# EAGLE schematic BumbleBoard_V0.1 (EAGLE 6.5.0)
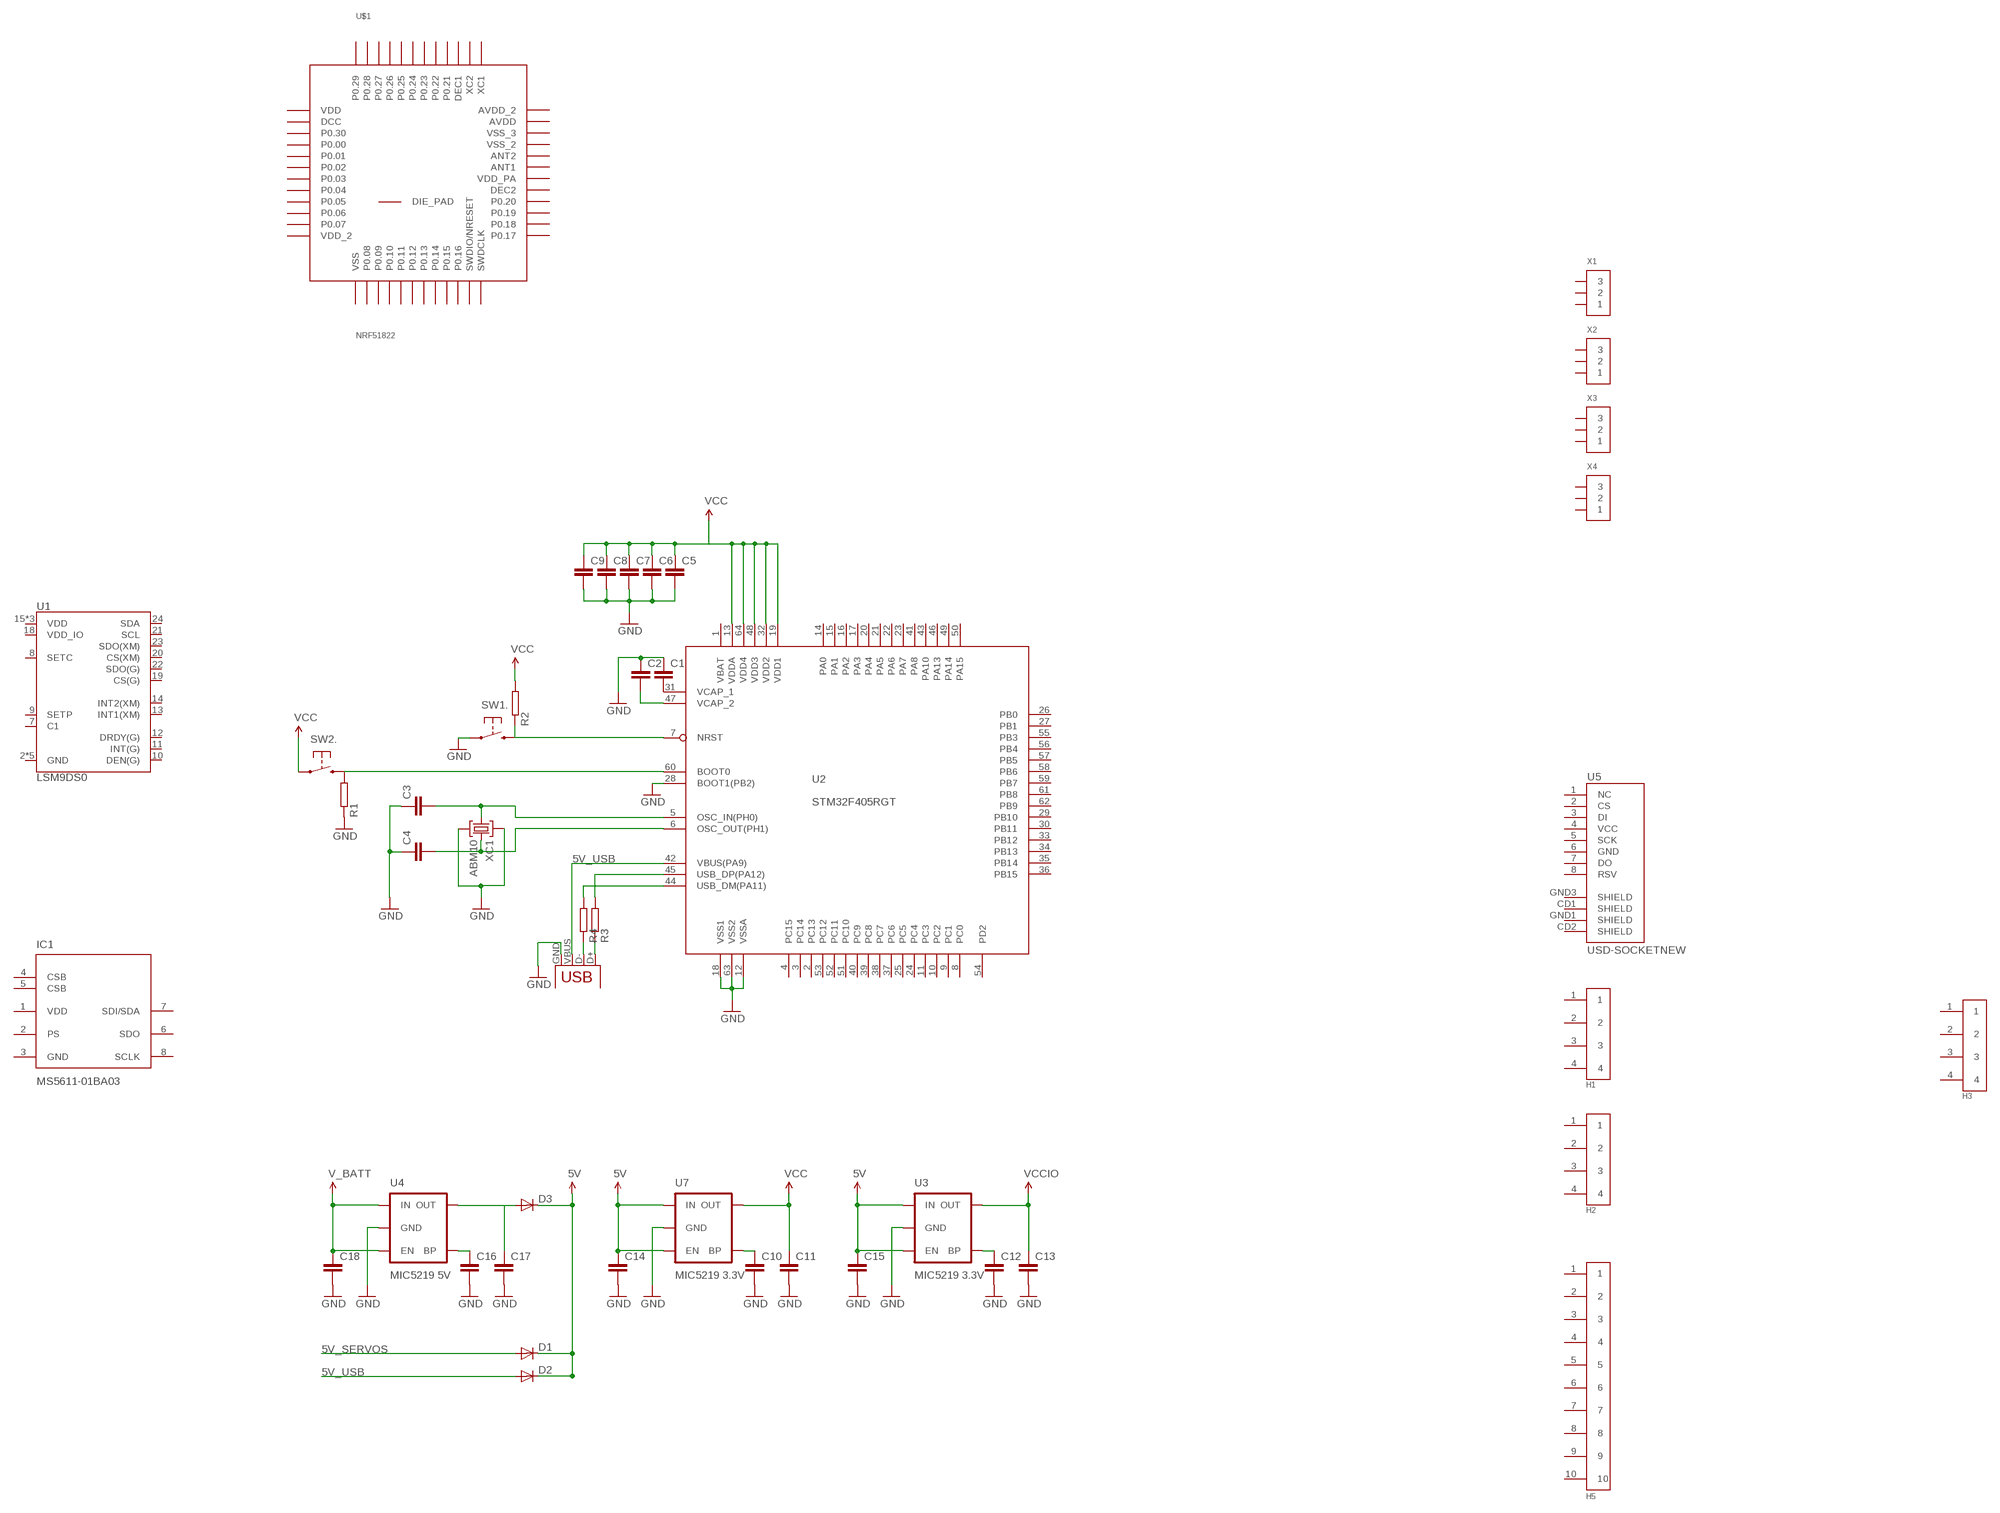
[diagram p0: schematic, sheet 1]

## Parts
C1  CAP0402-CAP  [0402-CAP]
C2  CAP0402-CAP  [0402-CAP]
C3  CAP0402-CAP  [0402-CAP]
C4  CAP0402-CAP  [0402-CAP]
C5  CAP0402-CAP  [0402-CAP]
C6  CAP0402-CAP  [0402-CAP]
C7  CAP0402-CAP  [0402-CAP]
C8  CAP0402-CAP  [0402-CAP]
C9  CAP0402-CAP  [0402-CAP]
C10  CAP0402-CAP  [0402-CAP]
C11  CAP0603-CAP  [0603-CAP]
C12  CAP0402-CAP  [0402-CAP]
C13  CAP0603-CAP  [0603-CAP]
C14  CAP0603-CAP  [0603-CAP]
C15  CAP0603-CAP  [0603-CAP]
C16  CAP0402-CAP  [0402-CAP]
C17  CAP0603-CAP  [0603-CAP]
C18  CAP0603-CAP  [0603-CAP]
D1  DIODESOD  [SOD-323]
D2  DIODESOD  [SOD-323]
D3  DIODESOD  [SOD-323]
H1  CON_4  [CON1.27_4]
H2  CON_4  [CON1.27_4]
H3  CON_4  [CON1.27_4]
H5  CON_10  [CON1.27_10]
IC1  MS5611-01BA03  [SON125P300X500X100-8N]
R1  RESISTOR-0402  [0402-RES]
R2  RESISTOR-0402  [0402-RES]
R3  RESISTOR-0402  [0402-RES]
R4  RESISTOR-0402  [0402-RES]
SW1  SWITCH-B3U-1110-BOSS  [SWITCH-TACT-B3U-1100P-B]
SW2  SWITCH-B3U-1110-BOSS  [SWITCH-TACT-B3U-1100P-B]
U1  LSM9DS0  [LGA-24]
U2  STM32F405RGT  [LQFP64]
U3  MIC5219 3.3V  V_REG_MIC52193.3V  [SOT23-5]
U4  MIC5219 5V  V_REG_MIC52195V  [SOT23-5]
U5  USD-SOCKETNEW  [MICRO-SD-SOCKET-PP]
U7  MIC5219 3.3V  V_REG_MIC52193.3V  [SOT23-5]
U$1  NRF51822  [QFN48]
X1  CONN_3-1-53047  [PB-53047-03]
X2  CONN_3-1-53047  [PB-53047-03]
X3  CONN_3-1-53047  [PB-53047-03]
X4  CONN_3-1-53047  [PB-53047-03]
X5  USB-MICROB  [USB-MICROB]
XC1  ABM10  [ABM10]

## Nets
5V: C14.1 C15.1 D1.1(C) D2.1(C) D3.1(C) U3.1(IN) U3.3(EN) U7.1(IN) U7.3(EN)
5V_SERVOS: D1.2(A)
5V_USB: D2.2(A) U2.42(VBUS(PA9)) X5.VBUS
GND: C1.1 C2.1 C3.1 C4.1 C5.2 C6.2 C7.2 C8.2 C9.2 C10.2 C11.2 C12.2 C13.2 C14.2 C15.2 C16.2 C17.2 C18.2 R1.P$1 SW1.1 U2.12(VSSA) U2.18(VSS1) U2.28(BOOT1(PB2)) U2.63(VSS2) U3.2(GND) U4.2(GND) U7.2(GND) X5.GND XC1.2 XC1.4
N$1: C1.2 U2.31(VCAP_1)
N$2: C2.2 U2.47(VCAP_2)
N$3: R1.P$2 SW2.2 U2.60(BOOT0)
N$4: R2.P$1 SW1.2 U2.7(NRST)
N$5: R4.P$1 X5.D-
N$6: C3.2 U2.5(OSC_IN(PH0)) XC1.1
N$7: C4.2 U2.6(OSC_OUT(PH1)) XC1.3
N$8: R3.P$1 X5.D+
N$9: R3.P$2 U2.45(USB_DP(PA12))
N$10: R4.P$2 U2.44(USB_DM(PA11))
N$12: C10.1 U7.4(BP)
N$13: C12.1 U3.4(BP)
N$14: C16.1 U4.4(BP)
N$15: C17.1 D3.2(A) U4.5(OUT)
V_BATT: C18.1 U4.1(IN) U4.3(EN)
VCC: C5.1 C6.1 C7.1 C8.1 C9.1 C11.1 R2.P$2 SW2.1 U2.13(VDDA) U2.19(VDD1) U2.32(VDD2) U2.48(VDD3) U2.64(VDD4) U7.5(OUT)
VCCIO: C13.1 U3.5(OUT)
Unconnected: H1.1 H1.2 H1.3 H1.4 H2.1 H2.2 H2.3 H2.4 H3.1 H3.2 H3.3 H3.4 H5.1 H5.2 H5.3 H5.4 H5.5 H5.6 H5.7 H5.8 H5.9 H5.10 IC1.2(PS) IC1.4(CSB) IC1.5(CSB) IC1.6(SDO) IC1.7(SDI/SDA) IC1.8(SCLK) SW1.BOSS SW2.BOSS U1.2(GND) U1.3(GND) U1.4(GND) U1.5(GND) U1.6(GND) U1.7(C1) U1.8(SETC) U1.9(SETP) U1.10(DEN(G)) U1.11(INT(G)) U1.12(DRDY(G)) U1.13(INT1(XM)) U1.14(INT2(XM)) U1.15(VDD) U1.16(VDD) U1.17(VDD) U1.18(VDD_IO) U1.19(CS(G)) U1.20(CS(XM)) U1.21(SCL) U1.22(SDO(G)) U1.23(SDO(XM)) U1.24(SDA) U2.2(PC13) U2.3(PC14) U2.4(PC15) U2.8(PC0) U2.9(PC1) U2.10(PC2) U2.11(PC3) U2.14(PA0) U2.15(PA1) U2.16(PA2) U2.17(PA3) U2.20(PA4) U2.21(PA5) U2.22(PA6) U2.23(PA7) U2.24(PC4) U2.25(PC5) U2.26(PB0) U2.27(PB1) U2.29(PB10) U2.30(PB11) U2.33(PB12) U2.34(PB13) U2.35(PB14) U2.36(PB15) U2.37(PC6) U2.38(PC7) U2.39(PC8) U2.40(PC9) U2.41(PA8) U2.43(PA10) U2.46(PA13) U2.49(PA14) U2.50(PA15) U2.51(PC10) U2.52(PC11) U2.53(PC12) U2.54(PD2) U2.55(PB3) U2.56(PB4) U2.57(PB5) U2.58(PB6) U2.59(PB7) U2.61(PB8) U2.62(PB9) U5.1(NC) U5.2(CS) U5.3(DI) U5.4(VCC) U5.5(SCK) U5.6(GND) U5.7(DO) U5.8(RSV) U5.CD1(SHIELD) U5.CD2(SHIELD) U5.GND1(SHIELD) U5.GND3(SHIELD) U$1.1(VDD) U$1.2(DCC) U$1.3(P0.30) U$1.4(P0.00) U$1.5(P0.01) U$1.6(P0.02) U$1.7(P0.03) U$1.8(P0.04) U$1.9(P0.05) U$1.10(P0.06) U$1.11(P0.07) U$1.12(VDD_2) U$1.13(VSS) U$1.14(P0.08) U$1.15(P0.09) U$1.16(P0.10) U$1.17(P0.11) U$1.18(P0.12) U$1.19(P0.13) U$1.20(P0.14) U$1.21(P0.15) U$1.22(P0.16) U$1.23(SWDIO/NRESET) U$1.24(SWDCLK) U$1.25(P0.17) U$1.26(P0.18) U$1.27(P0.19) U$1.28(P0.20) U$1.29(DEC2) U$1.30(VDD_PA) U$1.31(ANT1) U$1.32(ANT2) U$1.33(VSS_2) U$1.34(VSS_3) U$1.35(AVDD) U$1.36(AVDD_2) U$1.37(XC1) U$1.38(XC2) U$1.39(DEC1) U$1.40(P0.21) U$1.41(P0.22) U$1.42(P0.23) U$1.43(P0.24) U$1.44(P0.25) U$1.45(P0.26) U$1.46(P0.27) U$1.47(P0.28) U$1.48(P0.29) U$1.GND(DIE_PAD) X1.1 X1.2 X1.3 X2.1 X2.2 X2.3 X3.1 X3.2 X3.3 X4.1 X4.2 X4.3

## Power pins joined to a net without a drawn wire
GND: IC1.3(GND)
VBAT: U2.1(VBAT)
VDD: IC1.1(VDD)

## Library data of the parts
C1-C18 = SparkFun-Capacitors:CAP: Capacitor Standard 0603 ceramic capacitor, and 0.1" leaded capacitor.
D1-D3 = power:DIODE: Diode These are standard reverse protection diodes and small signal diodes. SMA package can handle up to about 1A. SOD-323 can handle about 200mA. What the SOD-323 package when ordering, there are some mfgs out there that are 5-pin packages.; DISTRIBUTOR: Digikey; ORDER_CODE: 568-4128-1-ND; PLACE_PART: YES
H1-H3 = Adrien:CON_4
H5 = Adrien:CON_10
IC1 = Measurement-Specialties:MS5611-01BA03: Variometer Module, with stainless steel cap
R1-R4 = pel_dipol_comp:RESISTOR
SW1 SW2 = con-special_purpose:SWITCH-B3U-1110
U1 = SparkFun-DigitalIC:LSM9DS0: LSM9DS0 3D Accelerometer, 3D Gyroscope, 3D Magnetomter Features: 3 acceleration channels, 3 angular rate channels, 3 magnetic field channels ±2/±4/±6/±8/±16 g linear acceleration full scale ±2/±4/±8/±12 gauss magnetic full scale ±245/±500/±2000 dps angular rate full scale 16-bit data output SPI / I2C serial interfaces Analog supply voltage 2.4 V to 3.6 V Power-down mode / low-power mode Programmable interrupt generators Embedded self-test Embedded temperature sensor Embedded FIFO Position and motion detection functions Click/double-click recognition
U2 = stm32:STM32F405RGT
U3 U7 = SparkFun-PowerIC:V_REG_MIC5219: V_REG MIC5219 Standard 3.3V and 5V 500mA LDO voltage regulator in SOT-23 layout. Micrel part MIC5219. BP (by-pass) pin is used to lower output noise with 470pF cap, may be left open.; PROD_ID: VREG-09872
U4 = SparkFun-PowerIC:V_REG_MIC5219: V_REG MIC5219 Standard 3.3V and 5V 500mA LDO voltage regulator in SOT-23 layout. Micrel part MIC5219. BP (by-pass) pin is used to lower output noise with 470pF cap, may be left open.; PROD_ID: VREG-10107
U5 = SparkFun-Connectors:USD-SOCKET: microSD Socket Push-push type uSD socket. Schematic element and footprint production proven. Spark Fun Electronics SKU : PRT-00127. tDoc lines correctly indicate media card edge positions when inserting (unlocked, locked, depressed).
U$1 = NordicSemi:NRF51822: Bluetooth 4.0 Low Energy/2.4Ghz NORDIC SEMICONDUCTOR
X1-X4 = pel_molex:CONN_3-1
X5 = con-special_purpose:USB: USB Connectors USB-B-PTH is fully proven SKU : PRT-00139 USB-miniB is fully proven SKU : PRT-00587 USB-A-PCB is untested. USB-A-H is throughly reviewed, but untested. Spark Fun Electronics SKU : PRT-00437 USB-B-SMT is throughly reviewed, but untested. Needs silkscreen touching up. USB-A-S has not been used/tested USB-MB-H has not been used/tested; DISTRIBUTOR: Digikey; ORDER_CODE: 609-4613-1-ND; PLACE_PART: YES
XC1 = stm32:ABM10: ABRACON - ABM10-25.000MHZ-E20-T - CRYSTAL, 25MHZ, 10PF, SMD Additional infos: @ Farnell <http://ch.farnell.com/abracon/abm10-25-000mhz-e20-t/crystal-25mhz-10pf-smd/dp/7941067> Abracon datasheet <http://www.abracon.com/Resonators/ABM10.pdf>